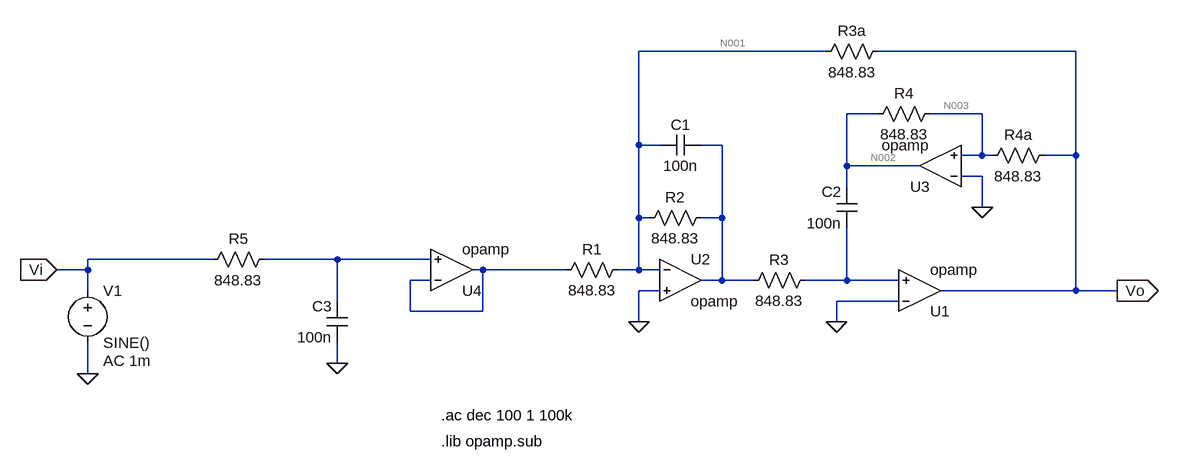
[diagram p0: schematic TS3_c.asc]
TS3_c.asc, the LTspice schematic file:
Version 4
SHEET 1 880 680
WIRE 48 -224 -240 -224
WIRE 432 -224 128 -224
WIRE 128 -128 80 -128
WIRE 288 -128 208 -128
WIRE -240 -80 -240 -224
WIRE -208 -80 -240 -80
WIRE -112 -80 -144 -80
WIRE 288 -64 288 -128
WIRE 288 -64 256 -64
WIRE 304 -64 288 -64
WIRE 432 -64 432 -224
WIRE 432 -64 384 -64
WIRE 80 -48 80 -128
WIRE 192 -48 80 -48
WIRE 288 -32 256 -32
WIRE 80 -16 80 -48
WIRE 288 16 288 -32
WIRE -240 32 -240 -80
WIRE -224 32 -240 32
WIRE -112 32 -112 -80
WIRE -112 32 -144 32
WIRE -896 96 -1088 96
WIRE -704 96 -816 96
WIRE -560 96 -704 96
WIRE -1088 112 -1088 96
WIRE -1088 112 -1136 112
WIRE -480 112 -496 112
WIRE -352 112 -480 112
WIRE -240 112 -240 32
WIRE -240 112 -272 112
WIRE -208 112 -240 112
WIRE -560 128 -592 128
WIRE -112 128 -112 32
WIRE -112 128 -144 128
WIRE -64 128 -112 128
WIRE 80 128 80 48
WIRE 80 128 16 128
WIRE 160 128 80 128
WIRE -1088 144 -1088 112
WIRE -208 144 -240 144
WIRE 432 144 432 -64
WIRE 432 144 224 144
WIRE 496 144 432 144
WIRE -704 160 -704 96
WIRE 160 160 64 160
WIRE -592 176 -592 128
WIRE -480 176 -480 112
WIRE -480 176 -592 176
WIRE -240 192 -240 144
WIRE 64 192 64 160
WIRE -704 256 -704 224
WIRE -1088 272 -1088 224
FLAG 64 192 0
FLAG -240 192 0
FLAG 288 16 0
FLAG -1088 272 0
FLAG 496 144 Vo
IOPIN 496 144 Out
FLAG -1136 112 Vi
IOPIN -1136 112 In
FLAG -704 256 0
SYMBOL OpAmps\\opamp 192 208 M180
SYMATTR InstName U1
SYMBOL OpAmps\\opamp -176 64 R0
SYMATTR InstName U2
SYMBOL OpAmps\\opamp 224 16 R180
SYMATTR InstName U3
SYMBOL res -256 96 R90
WINDOW 0 0 56 VBottom 2
WINDOW 3 32 56 VTop 2
SYMATTR InstName R1
SYMATTR Value 848.83
SYMBOL res -128 16 R90
WINDOW 0 0 56 VBottom 2
WINDOW 3 32 56 VTop 2
SYMATTR InstName R2
SYMATTR Value 848.83
SYMBOL res 32 112 R90
WINDOW 0 0 56 VBottom 2
WINDOW 3 32 56 VTop 2
SYMATTR InstName R3
SYMATTR Value 848.83
SYMBOL res 400 -80 R90
WINDOW 0 0 56 VBottom 2
WINDOW 3 32 56 VTop 2
SYMATTR InstName R4a
SYMATTR Value 848.83
SYMBOL res 224 -144 R90
WINDOW 0 0 56 VBottom 2
WINDOW 3 32 56 VTop 2
SYMATTR InstName R4
SYMATTR Value 848.83
SYMBOL res 144 -240 R90
WINDOW 0 0 56 VBottom 2
WINDOW 3 32 56 VTop 2
SYMATTR InstName R3a
SYMATTR Value 848.83
SYMBOL cap 96 48 R180
WINDOW 0 24 56 Left 2
WINDOW 3 24 8 Left 2
SYMATTR InstName C2
SYMATTR Value 100n
SYMBOL cap -144 -96 R90
WINDOW 0 0 32 VBottom 2
WINDOW 3 32 32 VTop 2
SYMATTR InstName C1
SYMATTR Value 100n
SYMBOL voltage -1088 128 R0
WINDOW 123 24 124 Left 2
WINDOW 39 0 0 Left 0
SYMATTR Value2 AC 1m
SYMATTR InstName V1
SYMATTR Value SINE()
SYMBOL OpAmps\\opamp -528 176 M180
SYMATTR InstName U4
SYMBOL res -800 80 R90
WINDOW 0 0 56 VBottom 2
WINDOW 3 32 56 VTop 2
SYMATTR InstName R5
SYMATTR Value 848.83
SYMBOL cap -688 224 R180
WINDOW 0 24 56 Left 2
WINDOW 3 24 8 Left 2
SYMATTR InstName C3
SYMATTR Value 100n
TEXT -544 376 Left 2 !.lib opamp.sub
TEXT -544 336 Left 2 !.ac dec 100 1 100k

The netlist it stands for:
* TS3_c.asc
XU1 0 N007 Vo opamp Aol=100K GBW=10Meg  ; pins invin noninvin out
XU2 N001 0 N004 opamp Aol=100K GBW=10Meg  ; pins invin noninvin out
XU3 0 N003 N002 opamp Aol=100K GBW=10Meg  ; pins invin noninvin out
R1 N001 N006 848.83
R2 N004 N001 848.83
R3 N007 N004 848.83
R4a Vo N003 848.83
R4 N003 N002 848.83
R3a Vo N001 848.83
C2 N007 N002 100n
C1 N004 N001 100n
V1 Vi 0 SINE() AC 1m
XU4 N006 N005 N006 opamp Aol=100K GBW=10Meg  ; pins invin noninvin out
R5 N005 Vi 848.83
C3 0 N005 100n
.lib opamp.sub
.ac dec 100 1 100k
.backanno
.end

* Results of the author's LTspice run, read from the files saved beside the schematic
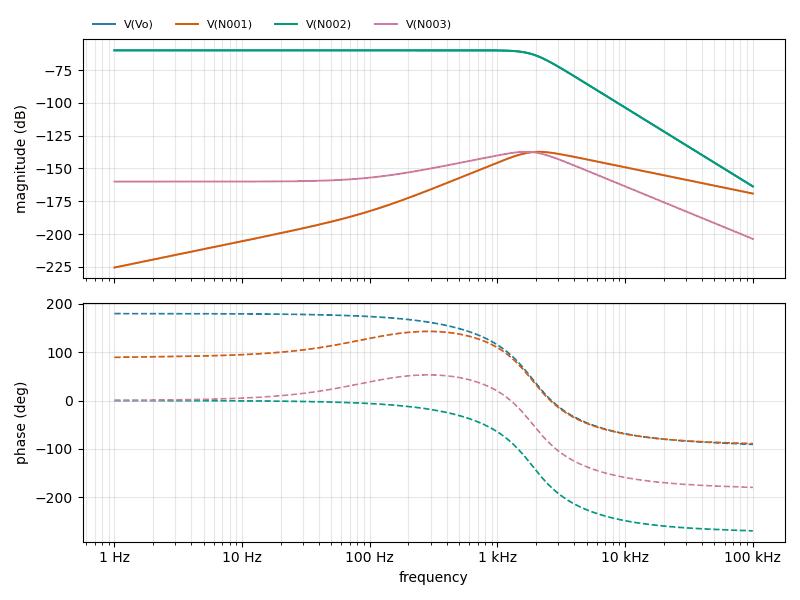
[diagram p1: AC Analysis of TS3_c.asc, plotted from the saved traces]
* AC Analysis, 1 run:
*   V(Vo): -60.00 dB at 1 Hz, -163.63 dB at 100 kHz, peak -60.00 dB at 309 Hz, 3 dB below the peak at 1.875 kHz
*   V(N001): -225.44 dB at 1 Hz, -169.08 dB at 100 kHz, peak -137.29 dB at 2.089 kHz, 3 dB below the peak at 1.398 kHz and 3.605 kHz
*   V(N002): -60.00 dB at 1 Hz, -163.63 dB at 100 kHz, peak -60.00 dB at 309 Hz, 3 dB below the peak at 1.875 kHz
*   V(N003): -159.99 dB at 1 Hz, -203.63 dB at 100 kHz, peak -137.28 dB at 1.66 kHz, 3 dB below the peak at 970.5 Hz and 2.51 kHz